# Altium project 节能组取电.PrjPCB
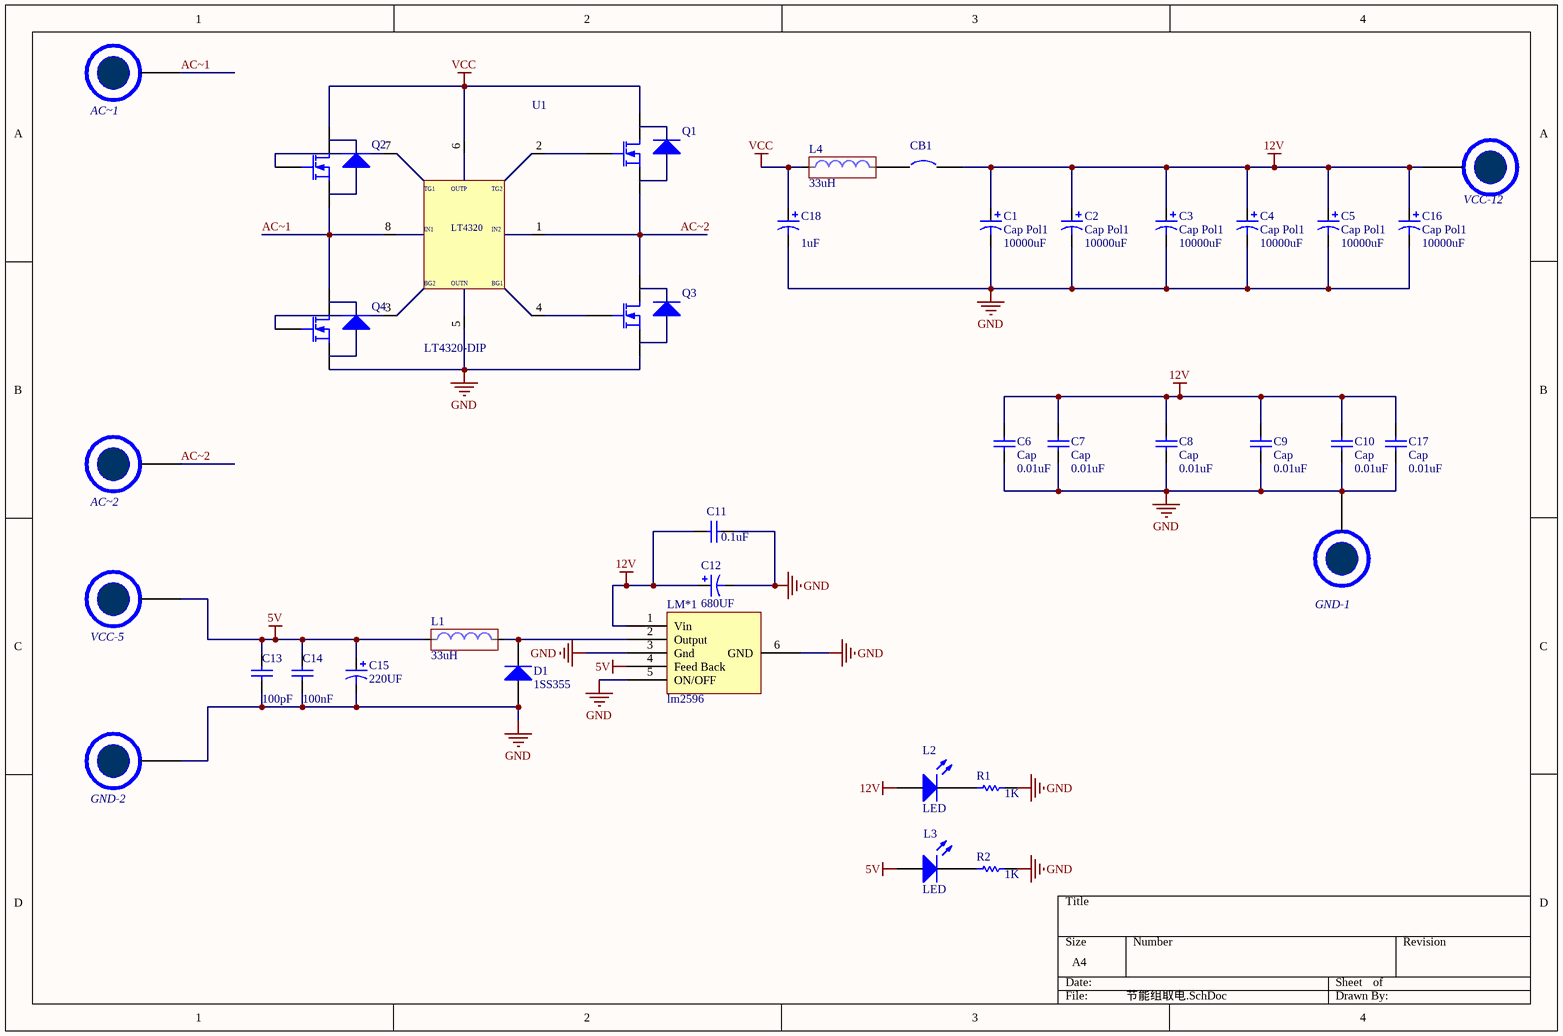
[diagram p0: 节能组取电.SchDoc]
1 sheet, 38 parts. Net scope: global (net labels, ports and power ports of the same name join across sheets).
Board files: 节能组取电.PcbDoc, 拼版.PcbDoc

## Sheet 节能组取电.SchDoc
size A4

### Parts
AC~1  PIN  [PIN]  (value not drawn)
AC~2  PIN  [PIN]  (value not drawn)
C1  Cap Pol1  value 10000uF  [RB7.6-15]
C2  Cap Pol1  value 10000uF  [RB7.6-15]
C3  Cap Pol1  value 10000uF  [RB7.6-15]
C4  Cap Pol1  value 10000uF  [RB7.6-15]
C5  Cap Pol1  value 10000uF  [RB7.6-15]
C6  Cap  value 0.01uF  [C2012]
C7  Cap  value 0.01uF  [C2012]
C8  Cap  value 0.01uF  [C2012]
C9  Cap  value 0.01uF  [C2012]
C10  Cap  value 0.01uF  [C2012]
C11  value 0.1uF  [C2012]  (hidden comment: Cap)
C12  680UF  [c2012]
C13  value 100pF  [C2012]  (hidden comment: Cap)
C14  value 100nF  [C2012]  (hidden comment: Cap)
C15  220UF  [SMD-EC-F8]
C16  Cap Pol1  value 10000uF  [RB7.6-15]
C17  Cap  value 0.01uF  [C2012]
C18  value 1uF  [C2012]  (hidden comment: Cap Pol1)
CB1  Circuit Breaker  [SPST-2]  (value not drawn)
D1  1SS355  [SK54]
GND-1  PIN  [PIN]  (value not drawn)
GND-2  PIN  [PIN]  (value not drawn)
L1  33uH  [SMD-EC-F6.3]
L2  LED  [C2012]
L3  LED  [C2012]
L4  33uH  [SMD-EC-F6.3]
LM*1  lm2596  [lm2596]
Q1  MOSFET-N  [mos]  (value not drawn)
Q2  MOSFET-N  [mos]  (value not drawn)
Q3  MOSFET-N  [mos]  (value not drawn)
Q4  MOSFET-N  [mos]  (value not drawn)
R1  value 1K  [R2012]  (hidden comment: Res)
R2  value 1K  [R2012]  (hidden comment: Res)
U1  LT4320-DIP  [DIP-8]
VCC-5  PIN  [PIN]  (value not drawn)
VCC-12  PIN  [PIN]  (value not drawn)

### Nets
5V: C13.2 C14.2 C15.1 L1.1 L3.1(A) LM*1.4(Feed_Back) VCC-5.1(PIN)
12V: C1.1 C2.1 C3.1 C4.1 C5.1 C6.2 C7.2 C8.2 C9.2 C10.2 C11.2 C12.1 C16.1 C17.2 CB1.2 L2.1(A) LM*1.1(Vin) VCC-12.1(PIN)
GND: C1.2 C2.2 C3.2 C4.2 C5.2 C6.1 C7.1 C8.1 C9.1 C10.1 C11.1 C12.2 C13.1 C14.1 C15.2 C16.2 C17.1 C18.2 D1.1(A) GND-1.1(PIN) GND-2.1(PIN) LM*1.3(Gnd) LM*1.5(ON/OFF) LM*1.6(GND) Q3.3(S) Q4.3(S) R1.2 R2.2 U1.5
VCC: C18.1 L4.1 Q1.2(D) Q2.2(D) U1.6
AC~1: AC~1.1(PIN) Q2.3(S) Q4.2(D) U1.8
AC~2: AC~2.1(PIN) Q1.3(S) Q3.2(D) U1.1
NetCB1_1: CB1.1 L4.2
NetD1_2: D1.2(K) L1.2 LM*1.2(Output)
NetL2_2: L2.2(K) R1.1
NetL3_2: L3.2(K) R2.1
NetQ1_1: Q1.1(G) U1.2
NetQ2_1: Q2.1(G) U1.7
NetQ3_1: Q3.1(G) U1.4
NetQ4_1: Q4.1(G) U1.3

### Notes on the sheet
- (in symbol LT4320-DIP) TG1; OUTP; TG2; IN1; LT4320; IN2; BG2; OUTN; BG1

### Library data of the parts
C1-C5 C16 C18 = Cap Pol1: Polarized Capacitor (Radial); Published: 8-Jun-2000; LatestRevisionDate: 17-Jul-2002; LatestRevisionNote: Re-released for DXP Platform.; PackageReference: RB7.6-15; Publisher: Altium Limited; PackageDescription: Polarized Capacitor (Radial); 2 Leads
C6-C11 C13 C14 C17 = Cap: Capacitor; Published: 8-Jun-2000; LatestRevisionDate: 17-Jul-2002; LatestRevisionNote: Re-released for DXP Platform.; PackageReference: RAD-0.3; Publisher: Altium Limited; PackageDescription: Radial Cap, Thru-Hole; 2 Leads; 0.3 in Pin Spacing
C12 C15 = CAP+
D1 = Diode 1N4148: High Conductance Fast Diode; LatestRevisionDate: 17-Jul-2002; LatestRevisionNote: Re-released for DXP Platform.; DatasheetDocument: 1997; PackageReference: DO-35; Publisher: Altium Limited; Code_JEDEC: DO-204-AH; ComponentLink1Description: Manufacturer Link; ComponentLink2Description: Datasheet; ComponentLink2URL: http://www.fairchildsemi.com/ds/1N%2F1N4148.pdf
L1 L4 = Inductor
Q1-Q4 = MOSFET-N: N-Channel MOSFET; PackageDocument: 1995/1996; Published: 8-Jun-2000; LatestRevisionDate: 17-Jul-2002; LatestRevisionNote: Re-released for DXP Platform.; PackageReference: E3; Publisher: Altium Limited
R1 R2 = Res: 贴片电阻; Published: 8-Jun-2000; LatestRevisionDate: 17-Jul-2002; LatestRevisionNote: Re-released for DXP Platform.; PackageReference: AXIAL-0.3; Publisher: Altium Limited
CB1 = Circuit Breaker: Published: 24-Mar-1999; LatestRevisionDate: 17-Jul-2002; LatestRevisionNote: Re-released for DXP Platform.; PackageReference: SPST-2; Publisher: Altium Limited; PackageDescription: Switch; 2 Leads